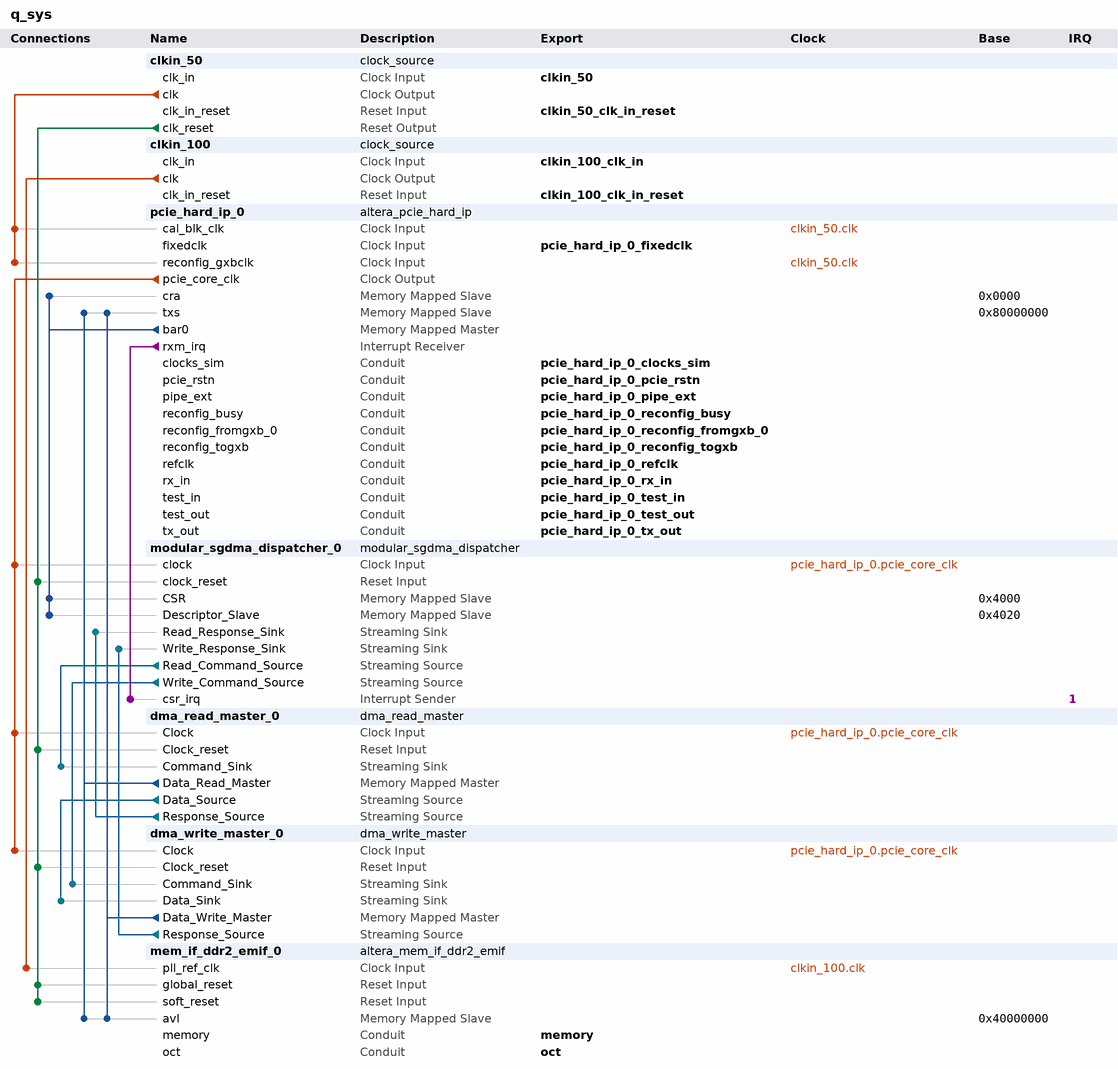
[diagram p0: system contents]
# Platform Designer (Qsys) system q_sys
# Parameters at their usual value, and those the tool derives, are not listed.
package require -exact qsys 12.0
create_system q_sys
set_project_property DEVICE_FAMILY {Stratix IV}

add_instance clkin_50 clock_source 12.0
set_instance_parameter_value clkin_50 clockFrequency 50000000

add_instance clkin_100 clock_source 12.0
set_instance_parameter_value clkin_100 clockFrequency 100000000

add_instance pcie_hard_ip_0 altera_pcie_hard_ip 12.0
set_instance_parameter_value pcie_hard_ip_0 max_link_width 4
set_instance_parameter_value pcie_hard_ip_0 p_pcie_test_out_width 64bits
set_instance_parameter_value pcie_hard_ip_0 {BAR Type} {32 bit Non-Prefetchable,Not used,Not used,Not used,Not used,Not used}
set_instance_parameter_value pcie_hard_ip_0 vendor_id 4466
set_instance_parameter_value pcie_hard_ip_0 device_id 3556
set_instance_parameter_value pcie_hard_ip_0 class_code 0
set_instance_parameter_value pcie_hard_ip_0 subsystem_vendor_id 4466
set_instance_parameter_value pcie_hard_ip_0 subsystem_device_id 4
set_instance_parameter_value pcie_hard_ip_0 my_advanced_errors false
set_instance_parameter_value pcie_hard_ip_0 my_enable_ecrc_check false
set_instance_parameter_value pcie_hard_ip_0 my_enable_ecrc_gen false
set_instance_parameter_value pcie_hard_ip_0 max_payload_size 1
set_instance_parameter_value pcie_hard_ip_0 CG_NO_CPL_REORDERING 0
set_instance_parameter_value pcie_hard_ip_0 CG_ENABLE_A2P_INTERRUPT 0
set_instance_parameter_value pcie_hard_ip_0 CB_A2P_ADDR_MAP_PASS_THRU_BITS 31
set_instance_parameter_value pcie_hard_ip_0 {PCIe Address 63:32} 0x00000000,0x00000000,0x00000000,0x00000000,0x00000000,0x00000000,0x00000000,0x00000000,0x00000000,0x00000000,0x00000000,0x00000000,0x00000000,0x00000000,0x00000000,0x00000000
set_instance_parameter_value pcie_hard_ip_0 {PCIe Address 31:0} 0x00000000,0x00000000,0x00000000,0x00000000,0x00000000,0x00000000,0x00000000,0x00000000,0x00000000,0x00000000,0x00000000,0x00000000,0x00000000,0x00000000,0x00000000,0x00000000

add_instance modular_sgdma_dispatcher_0 modular_sgdma_dispatcher 1.0
set_instance_parameter_value modular_sgdma_dispatcher_0 MODE 0
set_instance_parameter_value modular_sgdma_dispatcher_0 GUI_RESPONSE_PORT 2
set_instance_parameter_value modular_sgdma_dispatcher_0 DESCRIPTOR_FIFO_DEPTH 64
set_instance_parameter_value modular_sgdma_dispatcher_0 ENHANCED_FEATURES 0
set_instance_parameter_value modular_sgdma_dispatcher_0 CSR_ADDRESS_WIDTH 3

add_instance dma_read_master_0 dma_read_master 1.0
set_instance_parameter_value dma_read_master_0 DATA_WIDTH 256
set_instance_parameter_value dma_read_master_0 LENGTH_WIDTH 19
set_instance_parameter_value dma_read_master_0 FIFO_DEPTH 256
set_instance_parameter_value dma_read_master_0 STRIDE_ENABLE 0
set_instance_parameter_value dma_read_master_0 GUI_STRIDE_WIDTH 1
set_instance_parameter_value dma_read_master_0 BURST_ENABLE 1
set_instance_parameter_value dma_read_master_0 GUI_MAX_BURST_COUNT 32
set_instance_parameter_value dma_read_master_0 GUI_PROGRAMMABLE_BURST_ENABLE 0
set_instance_parameter_value dma_read_master_0 GUI_BURST_WRAPPING_SUPPORT 0
set_instance_parameter_value dma_read_master_0 TRANSFER_TYPE {Full Word Accesses Only}
set_instance_parameter_value dma_read_master_0 PACKET_ENABLE 0
set_instance_parameter_value dma_read_master_0 ERROR_ENABLE 0
set_instance_parameter_value dma_read_master_0 ERROR_WIDTH 8
set_instance_parameter_value dma_read_master_0 CHANNEL_ENABLE 0
set_instance_parameter_value dma_read_master_0 CHANNEL_WIDTH 8
set_instance_parameter_value dma_read_master_0 ADDRESS_WIDTH 32
set_instance_parameter_value dma_read_master_0 FIFO_SPEED_OPTIMIZATION 1

add_instance dma_write_master_0 dma_write_master 1.0
set_instance_parameter_value dma_write_master_0 DATA_WIDTH 256
set_instance_parameter_value dma_write_master_0 LENGTH_WIDTH 19
set_instance_parameter_value dma_write_master_0 FIFO_DEPTH 256
set_instance_parameter_value dma_write_master_0 STRIDE_ENABLE 0
set_instance_parameter_value dma_write_master_0 GUI_STRIDE_WIDTH 1
set_instance_parameter_value dma_write_master_0 BURST_ENABLE 1
set_instance_parameter_value dma_write_master_0 GUI_MAX_BURST_COUNT 32
set_instance_parameter_value dma_write_master_0 GUI_PROGRAMMABLE_BURST_ENABLE 0
set_instance_parameter_value dma_write_master_0 GUI_BURST_WRAPPING_SUPPORT 0
set_instance_parameter_value dma_write_master_0 TRANSFER_TYPE {Full Word Accesses Only}
set_instance_parameter_value dma_write_master_0 PACKET_ENABLE 0
set_instance_parameter_value dma_write_master_0 ERROR_ENABLE 0
set_instance_parameter_value dma_write_master_0 ERROR_WIDTH 8
set_instance_parameter_value dma_write_master_0 ADDRESS_WIDTH 32
set_instance_parameter_value dma_write_master_0 FIFO_SPEED_OPTIMIZATION 1

add_instance mem_if_ddr2_emif_0 altera_mem_if_ddr2_emif 12.0
set_instance_parameter_value mem_if_ddr2_emif_0 MEM_CLK_FREQ 400.0
set_instance_parameter_value mem_if_ddr2_emif_0 MEM_ROW_ADDR_WIDTH 14
set_instance_parameter_value mem_if_ddr2_emif_0 MEM_COL_ADDR_WIDTH 10
set_instance_parameter_value mem_if_ddr2_emif_0 MEM_DQ_WIDTH 64
set_instance_parameter_value mem_if_ddr2_emif_0 MEM_BANKADDR_WIDTH 3
set_instance_parameter_value mem_if_ddr2_emif_0 MEM_NUMBER_OF_RANKS_PER_DIMM 1
set_instance_parameter_value mem_if_ddr2_emif_0 MEM_TCL 7
set_instance_parameter_value mem_if_ddr2_emif_0 TIMING_TIH 375
set_instance_parameter_value mem_if_ddr2_emif_0 TIMING_TDS 50
set_instance_parameter_value mem_if_ddr2_emif_0 TIMING_TDH 125
set_instance_parameter_value mem_if_ddr2_emif_0 TIMING_TDQSQ 200
set_instance_parameter_value mem_if_ddr2_emif_0 TIMING_TQHS 300
set_instance_parameter_value mem_if_ddr2_emif_0 MEM_TMRD_CK 2
set_instance_parameter_value mem_if_ddr2_emif_0 MEM_TRAS_NS 40.0
set_instance_parameter_value mem_if_ddr2_emif_0 POWER_OF_TWO_BUS false
set_instance_parameter_value mem_if_ddr2_emif_0 AVL_MAX_SIZE 4
set_instance_parameter_value mem_if_ddr2_emif_0 REF_CLK_FREQ 100.0
set_instance_parameter_value mem_if_ddr2_emif_0 DEFAULT_FAST_SIM_MODEL true
set_instance_parameter_value mem_if_ddr2_emif_0 PLL_SHARING_MODE None
set_instance_parameter_value mem_if_ddr2_emif_0 CALIBRATION_MODE Skip
set_instance_parameter_value mem_if_ddr2_emif_0 USER_DEBUG_LEVEL 1
set_instance_parameter_value mem_if_ddr2_emif_0 TIMING_BOARD_AC_TO_CK_SKEW 0.0
set_instance_parameter_value mem_if_ddr2_emif_0 DLL_SHARING_MODE None

# connections
add_connection clkin_50.clk pcie_hard_ip_0.cal_blk_clk clock
add_connection clkin_50.clk pcie_hard_ip_0.reconfig_gxbclk clock
add_connection clkin_100.clk mem_if_ddr2_emif_0.pll_ref_clk clock
add_connection pcie_hard_ip_0.pcie_core_clk dma_read_master_0.Clock clock
add_connection pcie_hard_ip_0.pcie_core_clk dma_write_master_0.Clock clock
add_connection pcie_hard_ip_0.pcie_core_clk modular_sgdma_dispatcher_0.clock clock
add_connection clkin_50.clk_reset dma_read_master_0.Clock_reset reset
add_connection clkin_50.clk_reset dma_write_master_0.Clock_reset reset
add_connection clkin_50.clk_reset mem_if_ddr2_emif_0.global_reset reset
add_connection clkin_50.clk_reset mem_if_ddr2_emif_0.soft_reset reset
add_connection clkin_50.clk_reset modular_sgdma_dispatcher_0.clock_reset reset
add_connection dma_read_master_0.Data_Read_Master mem_if_ddr2_emif_0.avl avalon
set_connection_parameter_value dma_read_master_0.Data_Read_Master/mem_if_ddr2_emif_0.avl baseAddress 0x40000000
add_connection dma_read_master_0.Data_Read_Master pcie_hard_ip_0.txs avalon
set_connection_parameter_value dma_read_master_0.Data_Read_Master/pcie_hard_ip_0.txs baseAddress 0x80000000
add_connection dma_write_master_0.Data_Write_Master mem_if_ddr2_emif_0.avl avalon
set_connection_parameter_value dma_write_master_0.Data_Write_Master/mem_if_ddr2_emif_0.avl baseAddress 0x40000000
add_connection dma_write_master_0.Data_Write_Master pcie_hard_ip_0.txs avalon
set_connection_parameter_value dma_write_master_0.Data_Write_Master/pcie_hard_ip_0.txs baseAddress 0x80000000
add_connection pcie_hard_ip_0.bar0 modular_sgdma_dispatcher_0.CSR avalon
set_connection_parameter_value pcie_hard_ip_0.bar0/modular_sgdma_dispatcher_0.CSR baseAddress 0x4000
add_connection pcie_hard_ip_0.bar0 modular_sgdma_dispatcher_0.Descriptor_Slave avalon
set_connection_parameter_value pcie_hard_ip_0.bar0/modular_sgdma_dispatcher_0.Descriptor_Slave baseAddress 0x4020
add_connection pcie_hard_ip_0.bar0 pcie_hard_ip_0.cra avalon
set_connection_parameter_value pcie_hard_ip_0.bar0/pcie_hard_ip_0.cra baseAddress 0x0000
add_connection dma_read_master_0.Data_Source dma_write_master_0.Data_Sink avalon_streaming
add_connection dma_read_master_0.Response_Source modular_sgdma_dispatcher_0.Read_Response_Sink avalon_streaming
add_connection dma_write_master_0.Response_Source modular_sgdma_dispatcher_0.Write_Response_Sink avalon_streaming
add_connection modular_sgdma_dispatcher_0.Read_Command_Source dma_read_master_0.Command_Sink avalon_streaming
add_connection modular_sgdma_dispatcher_0.Write_Command_Source dma_write_master_0.Command_Sink avalon_streaming
add_connection pcie_hard_ip_0.rxm_irq modular_sgdma_dispatcher_0.csr_irq interrupt
set_connection_parameter_value pcie_hard_ip_0.rxm_irq/modular_sgdma_dispatcher_0.csr_irq irqNumber 1

# exported interfaces
add_interface clkin_100_clk_in_reset reset sink
set_interface_property clkin_100_clk_in_reset EXPORT_OF clkin_100.clk_in_reset
add_interface clkin_100_clk_in clock sink
set_interface_property clkin_100_clk_in EXPORT_OF clkin_100.clk_in
add_interface clkin_50 clock sink
set_interface_property clkin_50 EXPORT_OF clkin_50.clk_in
add_interface pcie_hard_ip_0_pipe_ext conduit end
set_interface_property pcie_hard_ip_0_pipe_ext EXPORT_OF pcie_hard_ip_0.pipe_ext
add_interface pcie_hard_ip_0_reconfig_busy conduit end
set_interface_property pcie_hard_ip_0_reconfig_busy EXPORT_OF pcie_hard_ip_0.reconfig_busy
add_interface pcie_hard_ip_0_pcie_rstn conduit end
set_interface_property pcie_hard_ip_0_pcie_rstn EXPORT_OF pcie_hard_ip_0.pcie_rstn
add_interface pcie_hard_ip_0_refclk conduit end
set_interface_property pcie_hard_ip_0_refclk EXPORT_OF pcie_hard_ip_0.refclk
add_interface pcie_hard_ip_0_reconfig_fromgxb_0 conduit end
set_interface_property pcie_hard_ip_0_reconfig_fromgxb_0 EXPORT_OF pcie_hard_ip_0.reconfig_fromgxb_0
add_interface pcie_hard_ip_0_reconfig_togxb conduit end
set_interface_property pcie_hard_ip_0_reconfig_togxb EXPORT_OF pcie_hard_ip_0.reconfig_togxb
add_interface pcie_hard_ip_0_tx_out conduit end
set_interface_property pcie_hard_ip_0_tx_out EXPORT_OF pcie_hard_ip_0.tx_out
add_interface pcie_hard_ip_0_rx_in conduit end
set_interface_property pcie_hard_ip_0_rx_in EXPORT_OF pcie_hard_ip_0.rx_in
add_interface clkin_50_clk_in_reset reset sink
set_interface_property clkin_50_clk_in_reset EXPORT_OF clkin_50.clk_in_reset
add_interface pcie_hard_ip_0_test_in conduit end
set_interface_property pcie_hard_ip_0_test_in EXPORT_OF pcie_hard_ip_0.test_in
add_interface pcie_hard_ip_0_clocks_sim conduit end
set_interface_property pcie_hard_ip_0_clocks_sim EXPORT_OF pcie_hard_ip_0.clocks_sim
add_interface pcie_hard_ip_0_test_out conduit end
set_interface_property pcie_hard_ip_0_test_out EXPORT_OF pcie_hard_ip_0.test_out
add_interface memory conduit end
set_interface_property memory EXPORT_OF mem_if_ddr2_emif_0.memory
add_interface oct conduit end
set_interface_property oct EXPORT_OF mem_if_ddr2_emif_0.oct
add_interface pcie_hard_ip_0_fixedclk clock sink
set_interface_property pcie_hard_ip_0_fixedclk EXPORT_OF pcie_hard_ip_0.fixedclk

save_system q_sys.qsys
